# Altium schematic sheet SH2 - 5V POWER.SchDoc: =documentname
size B; Organization: UW Robotics; Address1: 200 University Avenue; Address2: Waterloo; Address3: Ontario; Address4: Canada N2L 3G6; DocumentNumber: 5; SheetNumber: 2
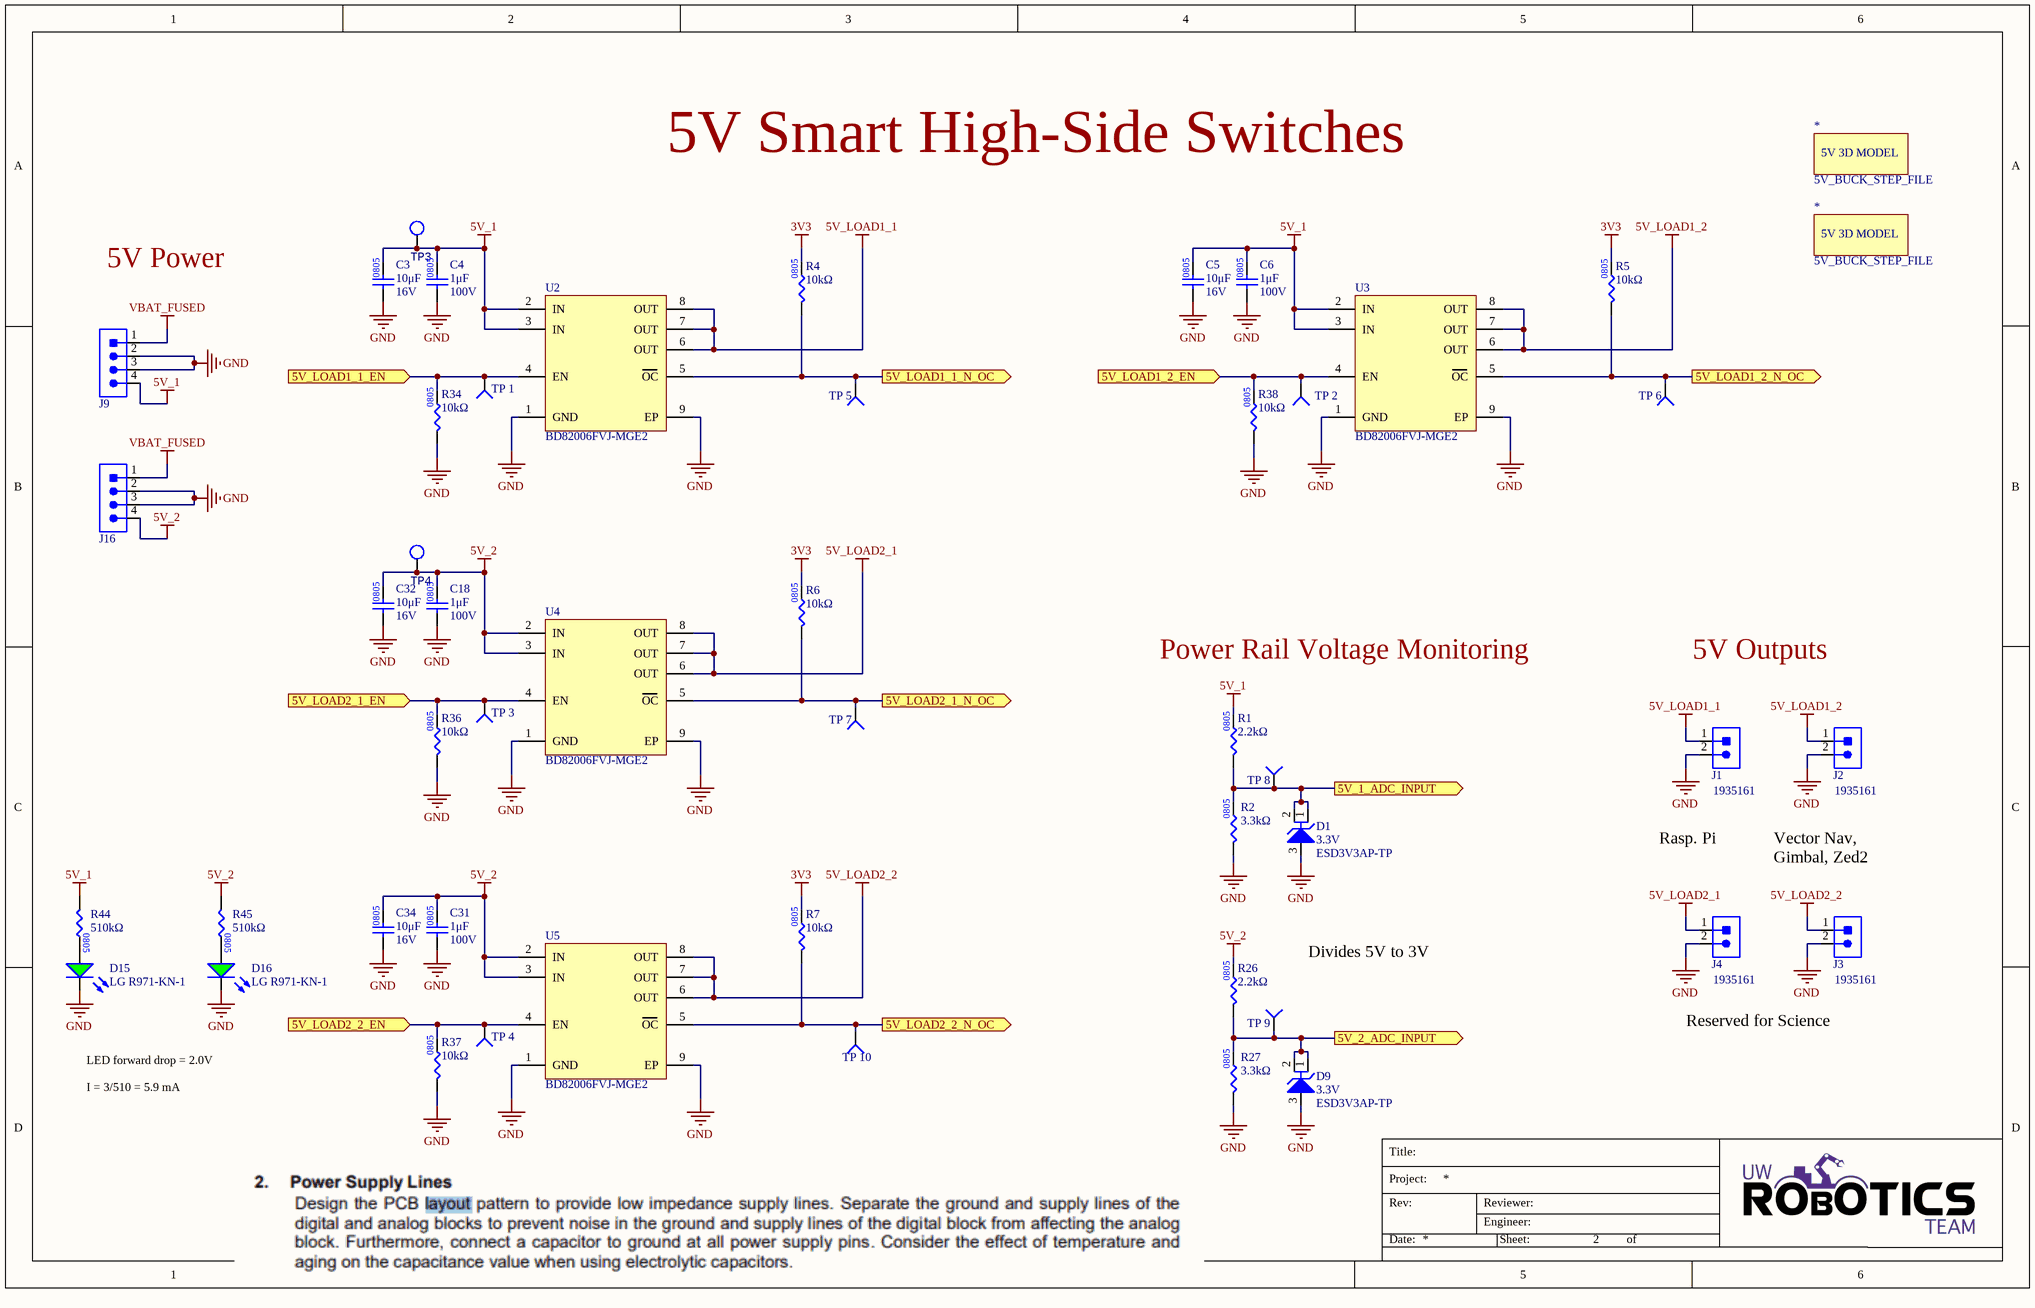
[diagram p0: SH2 - 5V POWER.SchDoc]

## Parts
(Parts that share a designator on the sheet are numbered #1, #2 ... from top to bottom, then left to right.)
*#1  5V_BUCK_STEP_FILE  [5V_BUCK_3D_MODEL]
*#2  5V_BUCK_STEP_FILE  [5V_BUCK_3D_MODEL]
C3  value 10μF  Voltage Rating: 16V  [CAP0805]  (hidden comment: CAP_10uF_16V_0805)
C4  value 1μF  Voltage Rating: 100V  [CAP0805]  (hidden comment: CAP_1uF_100V_0805)
C5  value 10μF  Voltage Rating: 16V  [CAP0805]  (hidden comment: CAP_10uF_16V_0805)
C6  value 1μF  Voltage Rating: 100V  [CAP0805]  (hidden comment: CAP_1uF_100V_0805)
C18  value 1μF  Voltage Rating: 100V  [CAP0805]  (hidden comment: CAP_1uF_100V_0805)
C31  value 1μF  Voltage Rating: 100V  [CAP0805]  (hidden comment: CAP_1uF_100V_0805)
C32  value 10μF  Voltage Rating: 16V  [CAP0805]  (hidden comment: CAP_10uF_16V_0805)
C34  value 10μF  Voltage Rating: 16V  [CAP0805]  (hidden comment: CAP_10uF_16V_0805)
D1  Voltage - Reverse Standoff (Typ): 3.3V  [ESD3V3AP-TP]  (hidden comment: TVS_DIODE_3.3V_13.3A)
D9  Voltage - Reverse Standoff (Typ): 3.3V  [ESD3V3AP-TP]  (hidden comment: TVS_DIODE_3.3V_13.3A)
D15  Manufacturer Part Number 1: LG R971-KN-1  [LED_0805_GREEN]  (hidden comment: LED_GREEN)
D16  Manufacturer Part Number 1: LG R971-KN-1  [LED_0805_GREEN]  (hidden comment: LED_GREEN)
J1  CON_2M_TERM  [1935161]  (value not drawn)
J2  CON_2M_TERM  [1935161]  (value not drawn)
J3  CON_2M_TERM  [1935161]  (value not drawn)
J4  CON_2M_TERM  [1935161]  (value not drawn)
J9  CON_2POS_SCREW_TERM  [MPS-04-7.70-01-L-V]  (value not drawn)
J16  CON_2POS_SCREW_TERM  [MPS-04-7.70-01-L-V]  (value not drawn)
R1  value 2.2kΩ  [RES0805]  (hidden comment: RES_2.2kΩ_0805)
R2  value 3.3kΩ  [RES0805]  (hidden comment: RES_3.3kΩ_0805_1%)
R4  value 10kΩ  [RES0805]  (hidden comment: RES_10kΩ_0805_5%)
R5  value 10kΩ  [RES0805]  (hidden comment: RES_10kΩ_0805_5%)
R6  value 10kΩ  [RES0805]  (hidden comment: RES_10kΩ_0805_5%)
R7  value 10kΩ  [RES0805]  (hidden comment: RES_10kΩ_0805_5%)
R26  value 2.2kΩ  [RES0805]  (hidden comment: RES_2.2kΩ_0805)
R27  value 3.3kΩ  [RES0805]  (hidden comment: RES_3.3kΩ_0805_1%)
R34  value 10kΩ  [RES0805]  (hidden comment: RES_10kΩ_0805_5%)
R36  value 10kΩ  [RES0805]  (hidden comment: RES_10kΩ_0805_5%)
R37  value 10kΩ  [RES0805]  (hidden comment: RES_10kΩ_0805_5%)
R38  value 10kΩ  [RES0805]  (hidden comment: RES_10kΩ_0805_5%)
R44  value 510kΩ  [RES0805]  (hidden comment: RES_510kΩ_0805_1%)
R45  value 510kΩ  [RES0805]  (hidden comment: RES_510kΩ_0805_1%)
TP3  TESTPOINT_LOOP  [TESTPOINT_LOOP]  (value not drawn)
TP4  TESTPOINT_LOOP  [TESTPOINT_LOOP]  (value not drawn)
TP_1  TESTPOINT_1MM_CIRCLE  [TESTPOINT_CIRCLE_1MM]  (value not drawn)  (no BOM)
TP_2  TESTPOINT_1MM_CIRCLE  [TESTPOINT_CIRCLE_1MM]  (value not drawn)  (no BOM)
TP_3  TESTPOINT_1MM_CIRCLE  [TESTPOINT_CIRCLE_1MM]  (value not drawn)  (no BOM)
TP_4  TESTPOINT_1MM_CIRCLE  [TESTPOINT_CIRCLE_1MM]  (value not drawn)  (no BOM)
TP_5  TESTPOINT_1MM_CIRCLE  [TESTPOINT_CIRCLE_1MM]  (value not drawn)  (no BOM)
TP_6  TESTPOINT_1MM_CIRCLE  [TESTPOINT_CIRCLE_1MM]  (value not drawn)  (no BOM)
TP_7  TESTPOINT_1MM_CIRCLE  [TESTPOINT_CIRCLE_1MM]  (value not drawn)  (no BOM)
TP_8  TESTPOINT_1MM_CIRCLE  [TESTPOINT_CIRCLE_1MM]  (value not drawn)  (no BOM)
TP_9  TESTPOINT_1MM_CIRCLE  [TESTPOINT_CIRCLE_1MM]  (value not drawn)  (no BOM)
TP_10  TESTPOINT_1MM_CIRCLE  [TESTPOINT_CIRCLE_1MM]  (value not drawn)  (no BOM)
U2  BD82006FVJ-MGE2  [8-TSSOP-BJ]
U3  BD82006FVJ-MGE2  [8-TSSOP-BJ]
U4  BD82006FVJ-MGE2  [8-TSSOP-BJ]
U5  BD82006FVJ-MGE2  [8-TSSOP-BJ]

## Ports
5V_1_ADC_INPUT (out), 5V_2_ADC_INPUT (out), 5V_LOAD1_1_EN (in), 5V_LOAD1_1_N_OC (out), 5V_LOAD1_2_EN (in), 5V_LOAD1_2_N_OC (out), 5V_LOAD2_1_EN (in), 5V_LOAD2_1_N_OC (out), 5V_LOAD2_2_EN (in), 5V_LOAD2_2_N_OC (out)

## Nets
3V3: R4.2 R5.2 R6.2 R7.2
5V_1: C3.2 C4.2 C5.2 C6.2 J9.4 R1.2 R44.1 TP3.1 U2.2(IN) U2.3(IN) U3.2(IN) U3.3(IN)
5V_2: C18.2 C31.2 C32.2 C34.2 J16.4 R26.2 R45.1 TP4.1 U4.2(IN) U4.3(IN) U5.2(IN) U5.3(IN)
5V_LOAD1_1: J1.1 U2.6(OUT) U2.7(OUT) U2.8(OUT)
5V_LOAD1_2: J2.1 U3.6(OUT) U3.7(OUT) U3.8(OUT)
5V_LOAD2_1: J4.1 U4.6(OUT) U4.7(OUT) U4.8(OUT)
5V_LOAD2_2: J3.1 U5.6(OUT) U5.7(OUT) U5.8(OUT)
GND: C3.1 C4.1 C5.1 C6.1 C18.1 C31.1 C32.1 C34.1 D1.3 D9.3 D15.2(K) D16.2(K) J1.2 J2.2 J3.2 J4.2 J9.2 J9.3 J16.2 J16.3 R2.1 R27.1 R34.1 R36.1 R37.1 R38.1 U2.1(GND) U2.9(EP) U3.1(GND) U3.9(EP) U4.1(GND) U4.9(EP) U5.1(GND) U5.9(EP)
VBAT_FUSED: J9.1 J16.1
5V_1_ADC_INPUT: D1.1 D1.2 R1.1 R2.2 TP_8.1(=value) ; port 5V_1_ADC_INPUT
5V_2_ADC_INPUT: D9.1 D9.2 R26.1 R27.2 TP_9.1(=value) ; port 5V_2_ADC_INPUT
5V_LOAD1_1_EN: R34.2 TP_1.1(=value) U2.4(EN) ; port 5V_LOAD1_1_EN
5V_LOAD1_1_N_OC: R4.1 TP_5.1(=value) U2.5(OC) ; port 5V_LOAD1_1_N_OC
5V_LOAD1_2_EN: R38.2 TP_2.1(=value) U3.4(EN) ; port 5V_LOAD1_2_EN
5V_LOAD1_2_N_OC: R5.1 TP_6.1(=value) U3.5(OC) ; port 5V_LOAD1_2_N_OC
5V_LOAD2_1_EN: R36.2 TP_3.1(=value) U4.4(EN) ; port 5V_LOAD2_1_EN
5V_LOAD2_1_N_OC: R6.1 TP_7.1(=value) U4.5(OC) ; port 5V_LOAD2_1_N_OC
5V_LOAD2_2_EN: R37.2 TP_4.1(=value) U5.4(EN) ; port 5V_LOAD2_2_EN
5V_LOAD2_2_N_OC: R7.1 TP_10.1(=value) U5.5(OC) ; port 5V_LOAD2_2_N_OC
NetD15_1: D15.1(A) R44.2
NetD16_1: D16.1(A) R45.2

## Notes on the sheet
- 5V Smart High-Side Switches
- 5V Power
- Power Rail Voltage Monitoring
- 5V Outputs
- Rasp. Pi
- Vector Nav, Gimbal, Zed2
- Divides 5V to 3V
- Reserved for Science
- LED forward drop = 2.0V
  I = 3/510 = 5.9 mA
- Title:
- Project:
- Date:
- Rev:
- Reviewer:
- Engineer:
- Sheet:
- of
- (in symbol 5V_BUCK_STEP_FILE) 5V 3D MODEL

## Library data of the parts
C3 C5 C32 C34 = CAP_10uF_16V_0805: CAP CER 10UF 16V X5R 0805; Manufacturer 1: Yageo; Manufacturer Part Number 1: CC0805KKX5R7BB106; Package/Footprint: 0805; Mounting Type: SMD; Supplier 1: Digi-Key; Supplier Part Number 1: 311-1865-1-ND; Dielectric: X5R
C4 C6 C18 C31 = CAP_1uF_100V_0805: CAP CER 1UF 100V X7S 0805; Supplier 1: Digi-Key; Mounting Type: SMD; Package: 0805; Supplier Part Number 1: 490-14464-1-ND
D1 D9 = TVS_DIODE_3.3V_13.3A: TVS DIODE 3.3VWM 7.5VC SOT23; Manufacturer 1: Micro Commercial Co; Package/Footprint: SOT-23; Voltage - Breakdown (Min): 5V; Voltage - Clamping (Max) @ Ipp: 7.5V; Mounting Type: SMD; Supplier 1: Digi-Key; Supplier Part Number 1: ESD3V3AP-TPMSCT-ND; Manufacturer Part Number 1: ESD3V3AP-TP
D15 D16 = LED_GREEN: LED GREEN DIFFUSED 0805 SMD; Manufacturer 1: OSRAM; Forward Voltage Drop: 2.2V; Package/Footprint: 0805; Mounting Type: SMD; Supplier 1: Digi-Key; Supplier Part Number 1: 475-1410-1-ND; Supplier 2: Future Electronics; Supplier Part Number 2: 1152237
J1-J4 = CON_2M_TERM: TERM BLK 2POS SIDE ENTRY 5MM; Manufacturer 1: Phoenix Contact; Max Current Rating: 16A; Current: 18A; Voltage: 300V; Package/Footprint: SMD; Supplier 1: Digi-Key; Supplier Part Number 1: 277-1667-ND; Manufacturer Part Number 1: 1935161; Mounting Type: TH
J9 J16 = CON_4POS_POWERBLADE_FEM: VERTICAL MINI-POWER SKT; Manufacturer 1: Samtec Inc.; Package/Footprint: PowerStrip™ 30 MPS; Supplier 1: Digi-Key; Mounting Type: TH; Supplier Part Number 1: SAM9721-ND; Manufacturer Part Number 1: MPS-04-7.70-01-L-V
R1 R26 = RES_2.2kΩ_0805_5%: RES 2.2K OHM 5% 1/8W 0805; Manufacturer 1: TE Connectivity Passive Product; Manufacturer Part Number 1: CRG0805F2K2; Tolerance: 1%; Supplier Part Number 1: A106060CT-ND; Supplier 1: Digi-Key; Package: 0805
R2 R27 = RES_3.3kΩ_0805_1%: RES 3.3K OHM 1% 1/8W 0805; Manufacturer 1: Vishay Dale; Manufacturer Part Number 1: CRCW06033K30FKEA; Supplier 1: Digi-Key; Supplier Part Number 1: 541-3.30KHCT-ND; LCSC Part #: C26010; Mounting Type: SMD; Package: 0805
R4-R7 R34 R36-R38 = RES_10kΩ_0805_5%: RES 10K OHM 5% 1/8W 0805; Manufacturer 1: Panasonic Electronic Components; Manufacturer Part Number 1: ERJ-6GEYJ103V; Package/Footprint: 0805; Supplier 1: Digi-Key; Supplier Part Number 1: P10KACT-ND; LCSC Part #: C17414; Mounting Type: SMD
R44 R45 = RES_510kΩ_0805_1%: RES 510K OHM 5% 1/8W 0805; Manufacturer 1: Stackpole Electronics Inc; Manufacturer Part Number 1: RMCF0805JT510K; Package/Footprint: 0805; Mounting Type: SMD; Supplier 1: Digi-Key; Supplier Part Number 1: RMCF0805JT510KCT-ND
TP3 TP4 = TESTPOINT_LOOP: TESTPOINT THRUHOLE; Manufacturer 1: Keystone Electronics; Manufacturer Part Number 1: 5002; Package/Footprint: TH; Supplier Part Number 1: 36-5002-ND; Supplier 1: Digi-Key; Mounting Type: TH
TP_1-TP_10 = TESTPOINT_1MM_CIRCLE: TESTPOINT 1MM CIRCLE
U2-U5 = BD82006FVJ-MGE2: IC PWR SWITCH N-CHAN 1:1 8TSSOP; Manufacturer 1: Rohm Semiconductor; Package/Footprint: 8-TSSOP; Rds On (Typ): 70mOhm; Mounting Type: SMD; Supplier 1: Digi-Key; Supplier Part Number 1: BD82006FVJ-MGE2CT-ND; Manufacturer Part Number 1: BD82006FVJ-MGE2